# Altium project FF_FINAL_PROJECT.PrjPcb (part 1 of 3)
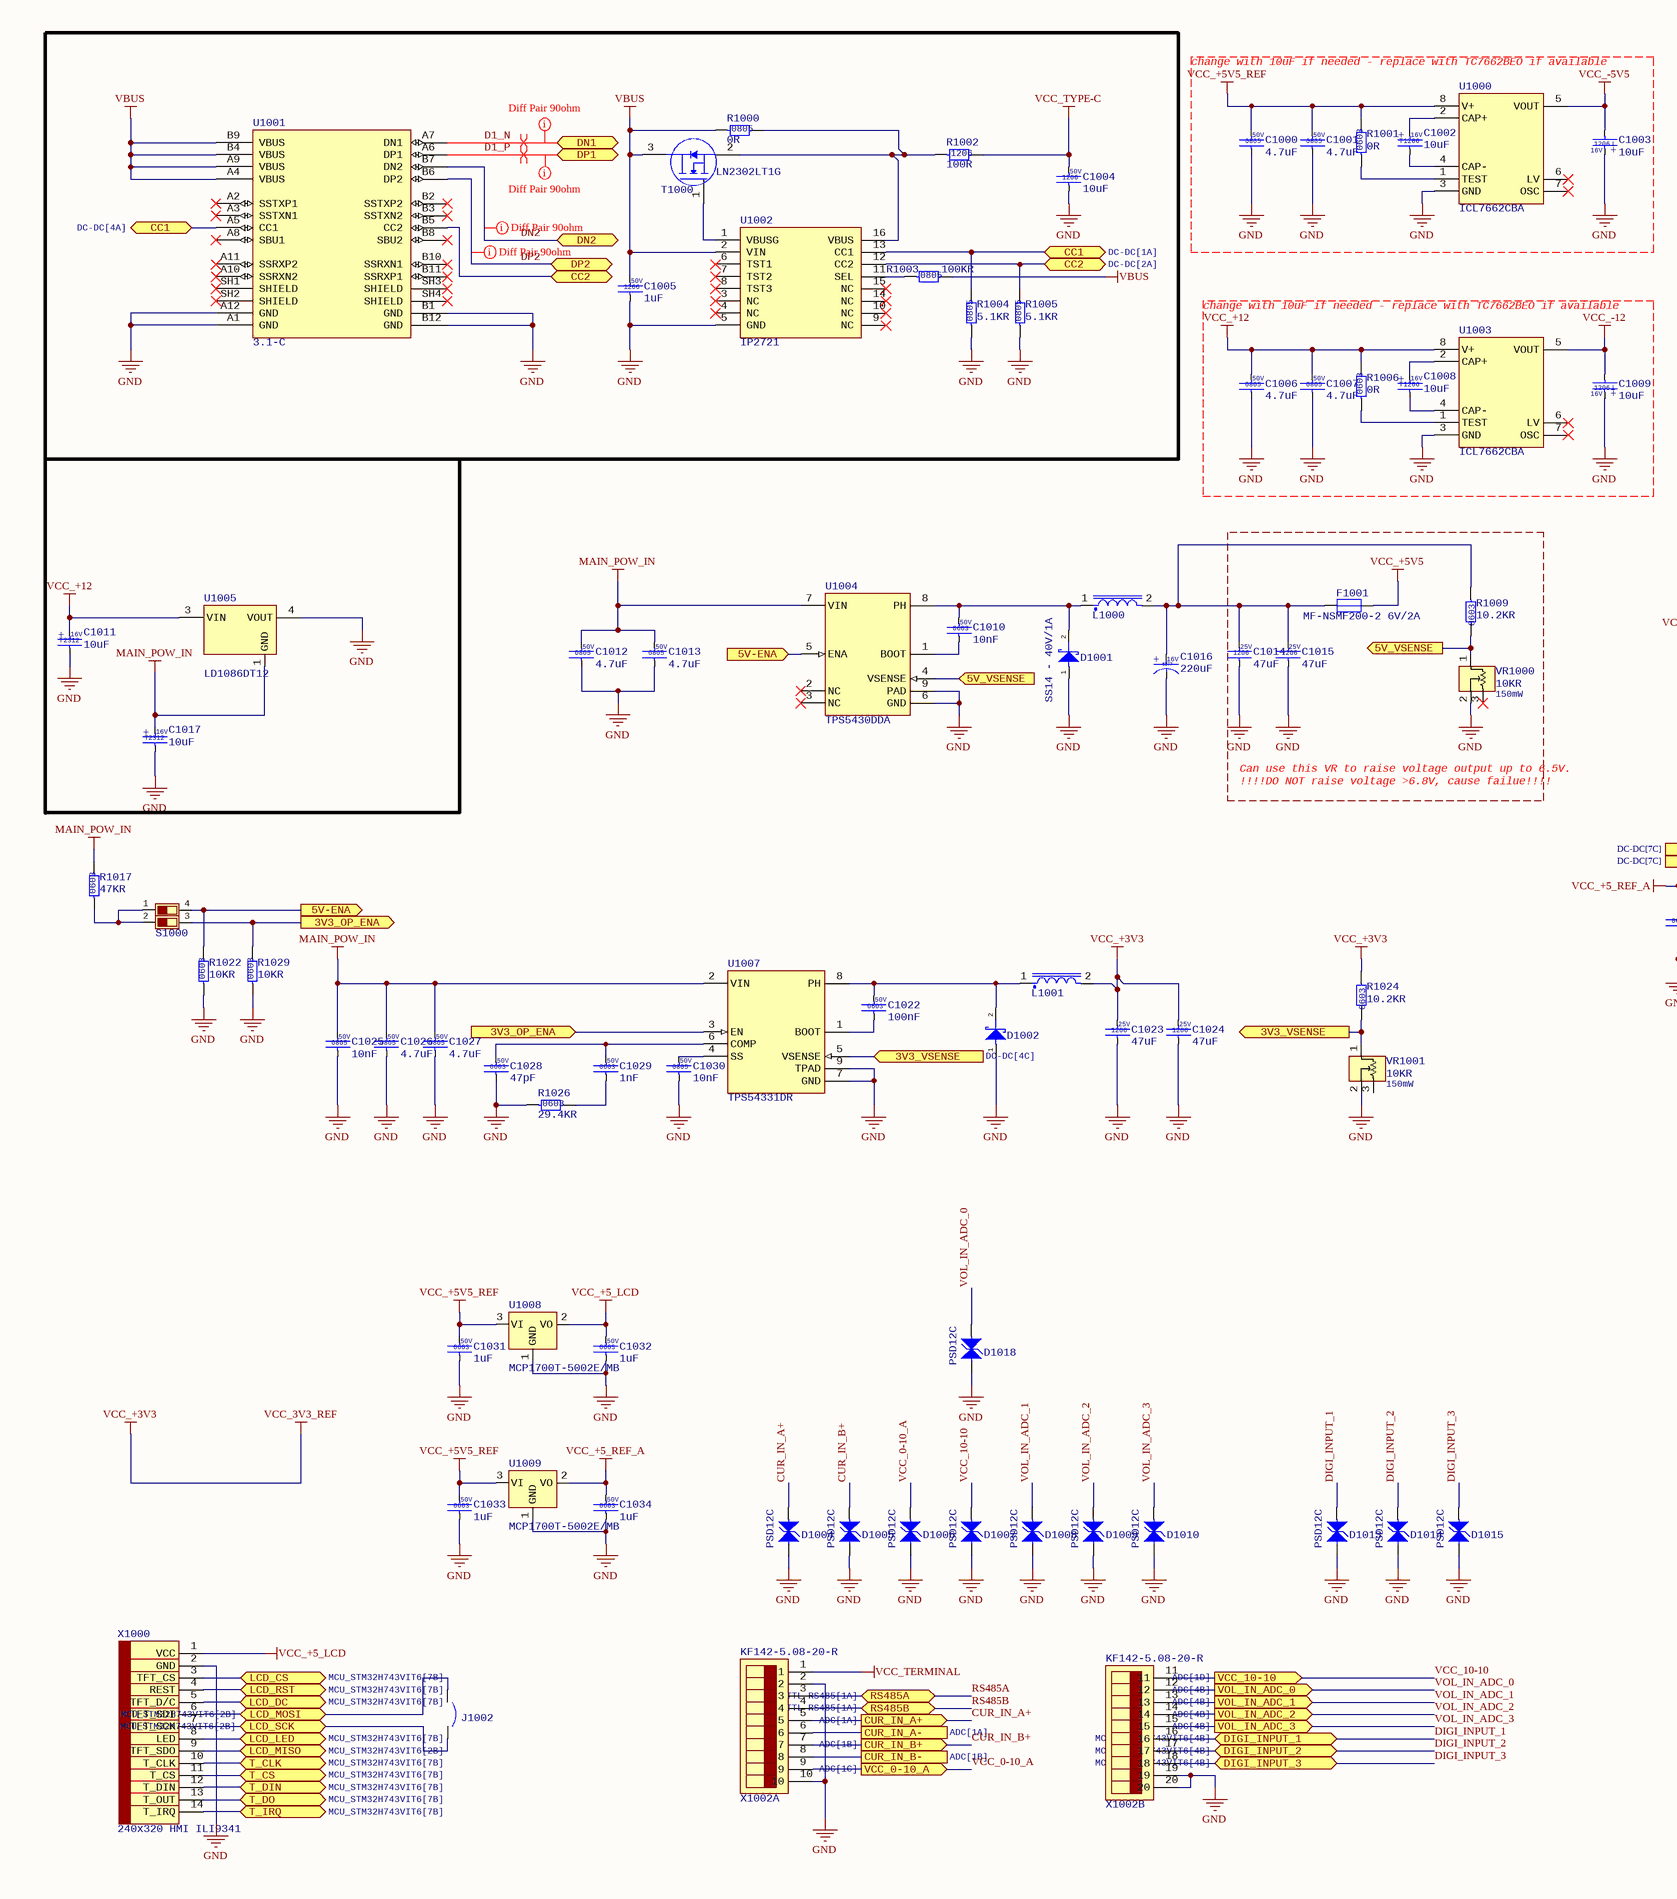
[diagram p0: DC-DC.SchDoc, left]
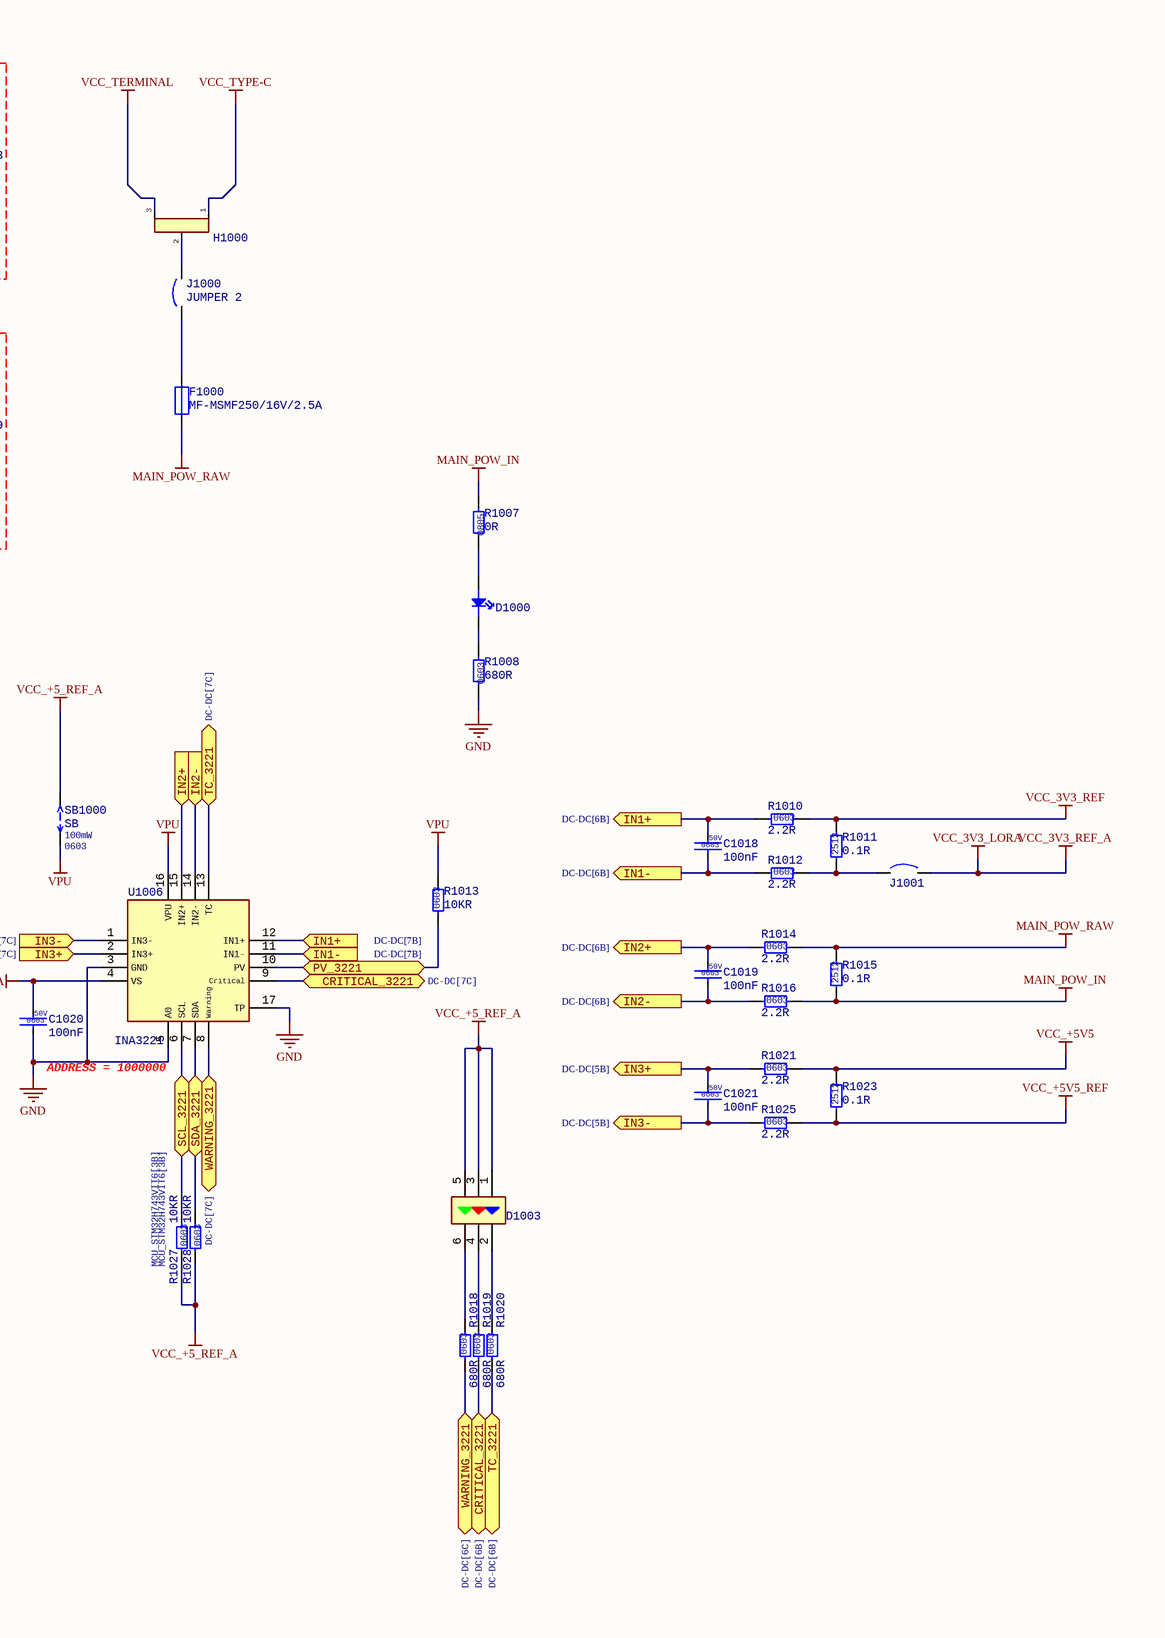
[diagram p1: DC-DC.SchDoc, right]
5 sheets, 337 parts. Net scope: flat (ports and power ports of the same name join across sheets).
Board files: FINAL_PCB_VER0.PcbDoc, FINAL_PCB_VER1.PcbDoc
Sheets:
  DC-DC.SchDoc
  TTL-RS485.SchDoc
  ADC.SchDoc
  ESP32-LORA_RA_08H.SchDoc
  MCU_STM32H743VIT6.SchDoc

## Sheet DC-DC.SchDoc
size A2; Author: Nguyễn Huy Hoàng; SheetNumber: 1; SheetTotal: 5; Instructor: Nguyễn Trung Hiếu

### Parts
C1000  4.7uF  Voltage: 50V  Size: 0805  [CAP CER 0805]
C1001  4.7uF  Voltage: 50V  Size: 0805  [CAP CER 0805]
C1002  10uF  Voltage: 16V  Size: 1206  [CAP TAN 1206]
C1003  10uF  Voltage: 16V  Size: 1206  [CAP TAN 1206]
C1004  10uF  Voltage: 50V  Size: 1206  [CAP CER 1206]
C1005  1uF  Voltage: 50V  Size: 1206  [CAP CER 1206]
C1006  4.7uF  Voltage: 50V  Size: 0805  [CAP CER 0805]
C1007  4.7uF  Voltage: 50V  Size: 0805  [CAP CER 0805]
C1008  10uF  Voltage: 16V  Size: 1206  [CAP TAN 1206]
C1009  10uF  Voltage: 16V  Size: 1206  [CAP TAN 1206]
C1010  10nF  Voltage: 50V  Size: 0603  [CAP CER 0603]
C1011  10uF  Voltage: 16V  Size: 2312  [CAP TAN 2312]
C1012  4.7uF  Voltage: 50V  Size: 0805  [CAP CER 0805]
C1013  4.7uF  Voltage: 50V  Size: 0805  [CAP CER 0805]
C1014  47uF  Voltage: 25V  Size: 1206  [CAP CER 1206]
C1015  47uF  Voltage: 25V  Size: 1206  [CAP CER 1206]
C1016  220uF  Voltage: 16V  Size: 6377  [CAP ALUM 6377]
C1017  10uF  Voltage: 16V  Size: 2312  [CAP TAN 2312]
C1018  100nF  Voltage: 50V  Size: 0603  [CAP CER 0603]
C1019  100nF  Voltage: 50V  Size: 0603  [CAP CER 0603]
C1020  100nF  Voltage: 50V  Size: 0603  [CAP CER 0603]
C1021  100nF  Voltage: 50V  Size: 0603  [CAP CER 0603]
C1022  100nF  Voltage: 50V  Size: 0603  [CAP CER 0603]
C1023  47uF  Voltage: 25V  Size: 1206  [CAP CER 1206]
C1024  47uF  Voltage: 25V  Size: 1206  [CAP CER 1206]
C1025  10nF  Voltage: 50V  Size: 0805  [CAP CER 0805]
C1026  4.7uF  Voltage: 50V  Size: 0805  [CAP CER 0805]
C1027  4.7uF  Voltage: 50V  Size: 0805  [CAP CER 0805]
C1028  47pF  Voltage: 50V  Size: 0603  [CAP CER 0603]
C1029  1nF  Voltage: 50V  Size: 0603  [CAP CER 0603]
C1030  10nF  Voltage: 50V  Size: 0805  [CAP CER 0805]
C1031  1uF  Voltage: 50V  Size: 0603  [CAP CER 0603]
C1032  1uF  Voltage: 50V  Size: 0603  [CAP CER 0603]
C1033  1uF  Voltage: 50V  Size: 0603  [CAP CER 0603]
C1034  1uF  Voltage: 50V  Size: 0603  [CAP CER 0603]
D1000  LED RED  [LED RED 0603]  (value not drawn)
D1001  SS14 - 40V/1A  [DO-214AC]
D1002  SS14 - 40V/1A  [DO-214AC]  (value not drawn)
D1003  LED RGB 5050  [LED RGB 5050]  (value not drawn)
D1004  PSD12C  [SOD-323]
D1005  PSD12C  [SOD-323]
D1006  PSD12C  [SOD-323]
D1007  PSD12C  [SOD-323]
D1008  PSD12C  [SOD-323]
D1009  PSD12C  [SOD-323]
D1010  PSD12C  [SOD-323]
D1013  PSD12C  [SOD-323]
D1014  PSD12C  [SOD-323]
D1015  PSD12C  [SOD-323]
D1018  PSD12C  [SOD-323]
F1000  MF-MSMF250/16V/2.5A  [FUSE 1812]
F1001  MF-NSMF200-2 6V/2A  [FUSE 1206]
H1000  3PIN JUMPER  [JUMPER 3]  (value not drawn)
J1000  JUMPER 2  [JUMPER 2]
J1001  JUMPER 2  [JUMPER 2]  (value not drawn)
J1002  JUMPER 2  [JUMPER 2]  (value not drawn)
L1000  LD127-22uH  [INDUCTOR 1280]  (value not drawn)
L1001  LD127-6.8uH  [INDUCTOR 1280]  (value not drawn)
R1000  0R  Size: 0805  [RESC 0805(2012) SMD]
R1001  0R  Size: 0603  [RESC 0603(1608) SMD]
R1002  100R  Size: 1206  [RESC 1206(3116) SMD]
R1003  100KR  Size: 0805  [RESC 0805(2012) SMD]
R1004  5.1KR  Size: 0805  [RESC 0805(2012) SMD]
R1005  5.1KR  Size: 0805  [RESC 0805(2012) SMD]
R1006  0R  Size: 0603  [RESC 0603(1608) SMD]
R1007  0R  Size: 0805  [RESC 0805(2012) SMD]
R1008  680R  Size: 0603  [RESC 0603(1608) SMD]
R1009  10.2KR  Size: 0603  [RESC 0603(1608) SMD]
R1010  2.2R  Size: 0603  [RESC 0603(1608) SMD]
R1011  0.1R  Size: 2512  [RESC 2512 SMD]
R1012  2.2R  Size: 0603  [RESC 0603(1608) SMD]
R1013  10KR  Size: 0603  [RESC 0603(1608) SMD]
R1014  2.2R  Size: 0603  [RESC 0603(1608) SMD]
R1015  0.1R  Size: 2512  [RESC 2512 SMD]
R1016  2.2R  Size: 0603  [RESC 0603(1608) SMD]
R1017  47KR  Size: 0603  [RESC 0603(1608) SMD]
R1018  680R  Size: 0603  [RESC 0603(1608) SMD]
R1019  680R  Size: 0603  [RESC 0603(1608) SMD]
R1020  680R  Size: 0603  [RESC 0603(1608) SMD]
R1021  2.2R  Size: 0603  [RESC 0603(1608) SMD]
R1022  10KR  Size: 0603  [RESC 0603(1608) SMD]
R1023  0.1R  Size: 2512  [RESC 2512 SMD]
R1024  10.2KR  Size: 0603  [RESC 0603(1608) SMD]
R1025  2.2R  Size: 0603  [RESC 0603(1608) SMD]
R1026  29.4KR  Size: 0603  [RESC 0603(1608) SMD]
R1027  10KR  Size: 0603  [RESC 0603(1608) SMD]
R1028  10KR  Size: 0603  [RESC 0603(1608) SMD]
R1029  10KR  Size: 0603  [RESC 0603(1608) SMD]
S1000  DIP-2  [DIP-2 SWITCH]  (value not drawn)
SB1000  SB  Power Rate: 100mW  Size: 0603  [SB]
T1000  LN2302LT1G  [SOT23-3]
U1000  ICL7662CBA  [SOP-8]
U1001  3.1-C  [USB TYPE C FEMALE]
U1002  IP2721  [TSSOP-16]
U1003  ICL7662CBA  [SOP-8]
U1004  TPS5430DDA  [SO PowerPAD]
U1005  LD1086DT12  [DPAK]
U1006  INA3221  [VQFN-16]
U1007  TPS54331DR  [SOIC-8]
U1008  MCP1700T-5002E/MB  [SOT23-3]
U1009  MCP1700T-5002E/MB  [SOT23-3]
VR1000  10KR  Power Rate: 150mW  [VARIABLE RESISTOR]
VR1001  10KR  Power Rate: 150mW  [VARIABLE RESISTOR]
X1000  240x320 HMI ILI9341  [LCD TFT320x240]
X1002  KF142-5.08-20-R  [TERMINAL BLOCK 20 5.08MM]  (parts A,B of 2)

### Ports
3V3_OP_ENA (in, see DC-DC[1B]), 3V3_OP_ENA (out, see DC-DC[2C]), 3V3_VSENSE (in, see DC-DC[4C]), 3V3_VSENSE (out, see DC-DC[3C]), 5V-ENA (in, see DC-DC[1B]), 5V-ENA (out, see DC-DC[3B]), 5V_VSENSE (in, see DC-DC[5B]), 5V_VSENSE (out, see DC-DC[3B]), CC1 (bidir, see DC-DC[1A]), CC1 (bidir, see DC-DC[4A]), CC2 (bidir, see DC-DC[2A]), CC2 (bidir, see DC-DC[4A]), CRITICAL_3221 (bidir, see DC-DC[6B]), CRITICAL_3221 (bidir, see DC-DC[7C]), CUR_IN_A+ (out, see ADC[1A]), CUR_IN_A- (see ADC[1A]), CUR_IN_B+ (out, see ADC[1B]), CUR_IN_B- (see ADC[1B]), DIGI_INPUT_1 (bidir, see MCU_STM32H743VIT6[4B]), DIGI_INPUT_2 (bidir, see MCU_STM32H743VIT6[4B]), DIGI_INPUT_3 (bidir, see MCU_STM32H743VIT6[4B]), DN1 (bidir, see MCU_STM32H743VIT6[1B], TTL-RS485[2C]), DN2 (bidir), DP1 (bidir, see MCU_STM32H743VIT6[1B], TTL-RS485[2C]), DP2 (bidir), IN1+ (in, see DC-DC[7B]), IN1+ (out, see DC-DC[6B]), IN1- (in, see DC-DC[7B]), IN1- (out, see DC-DC[6B]), IN2+ (in, see DC-DC[7B]), IN2+ (out, see DC-DC[6B]), IN2- (in, see DC-DC[7B]), IN2- (out, see DC-DC[6B]), IN3+ (in, see DC-DC[7C]), IN3+ (out, see DC-DC[5B]), IN3- (in, see DC-DC[7C]), IN3- (out, see DC-DC[5B]), LCD_CS (bidir, see MCU_STM32H743VIT6[7B]), LCD_DC (bidir, see MCU_STM32H743VIT6[7B]), LCD_LED (bidir, see MCU_STM32H743VIT6[7B]), LCD_MISO (bidir, see MCU_STM32H743VIT6[2B]), LCD_MOSI (bidir, see MCU_STM32H743VIT6[2B]), LCD_RST (bidir, see MCU_STM32H743VIT6[7B]), LCD_SCK (bidir, see MCU_STM32H743VIT6[2B]), PV_3221 (bidir), RS485A (bidir, see TTL-RS485[1A]), RS485B (bidir, see TTL-RS485[1A]), SCL_3221 (bidir, see MCU_STM32H743VIT6[3B]), SDA_3221 (bidir, see MCU_STM32H743VIT6[3B]), T_CLK (bidir, see MCU_STM32H743VIT6[7B]), T_CS (bidir, see MCU_STM32H743VIT6[7B]), T_DIN (bidir, see MCU_STM32H743VIT6[7B]), T_DO (bidir, see MCU_STM32H743VIT6[7B]), T_IRQ (bidir, see MCU_STM32H743VIT6[7B]), TC_3221 (bidir, see DC-DC[6B]), TC_3221 (bidir, see DC-DC[7C]), VCC_0-10_A (out, see ADC[1C]), VCC_10-10 (out, see ADC[1D]), VOL_IN_ADC_0 (out, see ADC[4B]), VOL_IN_ADC_1 (out, see ADC[4B]), VOL_IN_ADC_2 (out, see ADC[4B]), VOL_IN_ADC_3 (out, see ADC[4B]), WARNING_3221 (bidir, see DC-DC[6C]), WARNING_3221 (bidir, see DC-DC[7C])

### Nets
GND: C1000.2 C1001.2 C1003.2(P) C1004.2 C1005.2 C1006.2 C1007.2 C1009.2(P) C1011.1(N) C1012.2 C1013.2 C1014.2 C1015.2 C1016.1(C) C1017.1(N) C1020.2 C1023.2 C1024.2 C1025.2 C1026.2 C1027.2 C1028.2 C1030.2 C1031.2 C1032.2 C1033.2 C1034.2 D1001.1(A) D1002.1(A) D1004.2 D1005.2 D1006.2 D1007.2 D1008.2 D1009.2 D1010.2 D1013.2 D1014.2 D1015.2 D1018.2 R1004.1 R1005.1 R1008.2 R1022.1 R1026.1 R1029.1 U1000.3(GND) U1001.A1(GND) U1001.A12(GND) U1001.B1(GND) U1001.B12(GND) U1002.5(GND) U1003.3(GND) U1004.6(GND) U1004.9(PAD) U1005.4(VOUT) U1006.3(GND) U1006.5(A0) U1006.17(TP) U1007.7(GND) U1007.9(TPAD) U1008.1(GND) U1009.1(GND) VR1000.2(b) VR1001.2(b) X1000.2(GND) X1002.2 X1002.6 X1002.8 X1002.10 X1002.19 X1002.20 ; port CUR_IN_A-, port CUR_IN_B-
MAIN_POW_IN: C1012.1 C1013.1 C1017.2(P) C1025.1 C1026.1 C1027.1 R1007.1 R1015.1 R1016.2 R1017.2 U1004.7(VIN) U1005.1(GND) U1007.2(VIN)
MAIN_POW_RAW: F1000.2 R1014.2 R1015.2
VBUS: C1005.1 R1000.1 R1003.2 T1000.3(D) U1001.A4(VBUS) U1001.A9(VBUS) U1001.B4(VBUS) U1001.B9(VBUS) U1002.2(VIN)
VCC_3V3_LORA: J1001.2  [also labelled VCC_3V3_REF_A]
VCC_+3V3: C1023.1 C1024.1 L1001.2 R1010.2 R1011.2 R1024.1  [also labelled VCC_3V3_REF]
VCC_+5_LCD: C1032.1 U1008.2(VO) X1000.1(VCC)
VCC_+5_REF_A: C1020.1 C1034.1 D1003.1 D1003.3 D1003.5 R1027.1 R1028.1 SB1000.2 U1006.4(VS) U1009.2(VO)
VCC_+5V5: F1001.2 R1021.2 R1023.2
VCC_+5V5_REF: C1000.1 C1001.1 C1031.1 C1033.1 R1001.2 R1023.1 R1025.2 U1000.8(V+) U1008.3(VI) U1009.3(VI)
VCC_+12: C1006.1 C1007.1 C1011.2(P) R1006.2 U1003.8(V+) U1005.3(VIN)
VCC_-5V5: C1003.1(N) U1000.5(VOUT)
VCC_-12: C1009.1(N) U1003.5(VOUT)
VCC_TERMINAL: H1000.3 X1002.1
VCC_TYPE-C: C1004.1 H1000.1 R1002.2
VPU: R1013.2 SB1000.1 U1006.16(VPU)
CUR_IN_A+: D1004.1 X1002.5 ; port CUR_IN_A+
CUR_IN_B+: D1005.1 X1002.7 ; port CUR_IN_B+
D1_N: U1001.A7(DN1) ; port DN1
D1_P: U1001.A6(DP1) ; port DP1
DIGI_INPUT_1: D1013.1 X1002.16 ; port DIGI_INPUT_1
DIGI_INPUT_2: D1014.1 X1002.17 ; port DIGI_INPUT_2
DIGI_INPUT_3: D1015.1 X1002.18 ; port DIGI_INPUT_3
DN2: U1001.B7(DN2) ; port DN2
DP2: U1001.B6(DP2) ; port DP2
I2C2_SCL: R1027.2 U1006.6(SCL) ; port SCL_3221
I2C2_SDA: R1028.2 U1006.7(SDA) ; port SDA_3221
MCU29: J1002.2 X1000.7(TFT_SCK) ; port LCD_SCK
MCU30: X1000.9(TFT_SDO) ; port LCD_MISO
MCU31: J1002.1 X1000.6(TFT_SDI) ; port LCD_MOSI
MCU37: X1000.3(TFT_CS) ; port LCD_CS
MCU38: X1000.4(REST) ; port LCD_RST
MCU39: X1000.5(TFT_D/C) ; port LCD_DC
MCU40: X1000.8(LED) ; port LCD_LED
MCU41: X1000.11(T_CS) ; port T_CS
MCU42: X1000.10(T_CLK) ; port T_CLK
MCU43: X1000.12(T_DIN) ; port T_DIN
MCU44: X1000.13(T_OUT) ; port T_DO
MCU45: X1000.14(T_IRQ) ; port T_IRQ
RS485A: X1002.3 ; port RS485A
RS485B: X1002.4 ; port RS485B
VCC_0-10_A: D1006.1 X1002.9 ; port VCC_0-10_A
VCC_10-10: D1007.1 X1002.11 ; port VCC_10-10
VOL_IN_ADC_0: D1018.1 X1002.12 ; port VOL_IN_ADC_0
VOL_IN_ADC_1: D1008.1 X1002.13 ; port VOL_IN_ADC_1
VOL_IN_ADC_2: D1009.1 X1002.14 ; port VOL_IN_ADC_2
VOL_IN_ADC_3: D1010.1 X1002.15 ; port VOL_IN_ADC_3
NetC1002_1: C1002.1(N) U1000.4(CAP-)
NetC1002_2: C1002.2(P) U1000.2(CAP+)
NetC1008_1: C1008.1(N) U1003.4(CAP-)
NetC1008_2: C1008.2(P) U1003.2(CAP+)
NetC1010_1: C1010.1 D1001.2(K) L1000.1 U1004.8(PH)
NetC1010_2: C1010.2 U1004.1(BOOT)
NetC1014_1: C1014.1 C1015.1 C1016.2(A) F1001.1 L1000.2 R1009.1
NetC1018_1: C1018.1 R1010.1 U1006.12(IN1+) ; port IN1+
NetC1018_2: C1018.2 R1012.1 U1006.11(IN1-) ; port IN1-
NetC1019_1: C1019.1 R1014.1 U1006.15(IN2+) ; port IN2+
NetC1019_2: C1019.2 R1016.1 U1006.14(IN2-) ; port IN2-
NetC1021_1: C1021.1 R1021.1 U1006.2(IN3+) ; port IN3+
NetC1021_2: C1021.2 R1025.1 U1006.1(IN3-) ; port IN3-
NetC1022_1: C1022.1 D1002.2(K) L1001.1 U1007.8(PH)
NetC1022_2: C1022.2 U1007.1(BOOT)
NetC1028_1: C1028.1 C1029.1 U1007.6(COMP)
NetC1029_2: C1029.2 R1026.2
NetC1030_1: C1030.1 U1007.4(SS)
NetD1000_1: D1000.1 R1007.2
NetD1000_2: D1000.2 R1008.1
NetD1003_2: D1003.2 R1020.2
NetD1003_4: D1003.4 R1019.2
NetD1003_6: D1003.6 R1018.2
NetF1000_1: F1000.1 J1000.1
NetH1000_2: H1000.2 J1000.2
NetJ1001_1: J1001.1 R1011.1 R1012.2
NetR1000_2: R1000.2 R1002.1 T1000.2(S) U1002.16(VBUS)
NetR1001_1: R1001.1 U1000.1(TEST)
NetR1003_1: R1003.1 U1002.11(SEL)
NetR1004_2: R1004.2 U1001.A5(CC1) U1002.13(CC1) ; port CC1
NetR1005_2: R1005.2 U1001.B5(CC2) U1002.12(CC2) ; port CC2
NetR1006_1: R1006.1 U1003.1(TEST)
NetR1009_2: R1009.2 U1004.4(VSENSE) VR1000.1(a) ; port 5V_VSENSE
NetR1013_1: R1013.1 U1006.10(PV) ; port PV_3221
NetR1017_1: R1017.1 S1000.1 S1000.2
NetR1018_1: R1018.1 U1006.8(Warning) ; port WARNING_3221
NetR1019_1: R1019.1 U1006.9(Critical) ; port CRITICAL_3221
NetR1020_1: R1020.1 U1006.13(TC) ; port TC_3221
NetR1022_2: R1022.2 S1000.4 U1004.5(ENA) ; port 5V-ENA
NetR1024_2: R1024.2 U1007.5(VSENSE) VR1001.1(a) ; port 3V3_VSENSE
NetR1029_2: R1029.2 S1000.3 U1007.3(EN) ; port 3V3_OP_ENA
NetT1000_1: T1000.1(G) U1002.1(VBUSG)

Not connected (* = marked no-connect by the designer): U1000 6(LV)* 7(OSC)*; U1001 A2(SSTXP1)* A3(SSTXN1)* A8(SBU1)* A10(SSRXN2)* A11(SSRXP2)* B2(SSTXP2)* B3(SSTXN2)* B8(SBU2)* B10(SSRXN1)* B11(SSRXP1)* SH1(SHIELD)* SH2(SHIELD)* SH3(SHIELD)* SH4(SHIELD)*; U1002 3(NC)* 4(NC)* 6(TST1)* 7(TST2)* 8(TST3)* 9(NC)* 10(NC)* 14(NC)* 15(NC)*; U1003 6(LV)* 7(OSC)*; U1004 2(NC)* 3(NC)*; VR1000 3(c)*; VR1001 3(c)

### Layout directives
mark named Diff Pair 90ohm: D1_N, D1_P, DN2, DP2
differential pair: D1_N, D1_P

### Notes on the sheet
- (near U1000) change with 10uF if needed - replace with TC7662BEO if available
- (near U1003) change with 10uF if needed - replace with TC7662BEO if available
- Can use this VR to raise voltage output up to 6.5V.
- !!!!DO NOT raise voltage >6.8V, cause failue!!!!
- ADDRESS = 1000000
- PROJECT:
- A2
- SIZE
- Author:
- Instructors:
- Project Document Name:
- Modified day:
- Approved by:
- (in symbol FF-1002) +
- (in symbol FF-1022) +; T
- (in symbol FF-1034) T; +

### Library data of the parts
C1000 C1001 C1006 C1007 C1012 C1013 C1026 C1027 = FF-1010: CAP CER SMD 4.7uF 10% 50V 0805; Type: CAP CER; Design Item ID: FF-1010; TH/SMD: SMD; Value: 4.7uF; Tolerance: 10%; Power Rate: N/A; Supplier: THEGIOIIC; Supplier Part Number: 10%, 0805 (2012 Metric); Supplier Link: https://www.thegioiic.com/tu-gom-0805-4-7uf-50v
C1002 C1003 C1008 C1009 = FF-1034: CAP TAN SMD 10uF 10% 16V 1206; Type: CAP TAN; Value: 10uF; Design Item ID: FF-1034; TH/SMD: SMD; Tolerance: 10%; Power Rate: N/A; Supplier: THEGIOIIC; Supplier Part Number: Tụ Tantalum 10uF 16V 1206 TAJA106K016RNJ; Supplier Link: https://www.thegioiic.com/tu-tantalum-10uf-16v-1206-taja106k016rnj
C1004 = FF-1019: CAP CER SMD 10uF 10% 50V 1206; Type: CAP CER; Design Item ID: FF-1019; TH/SMD: SMD; Value: 10uF; Tolerance: 10%; Power Rate: N/A; Supplier: THEGIOIIC; Supplier Part Number: 10%, 1206 (3216 Metric); Supplier Link: https://www.thegioiic.com/tu-gom-1206-10uf-50v
C1005 = FF-1018: CAP CER SMD 1uF 10% 50V 1206; Type: CAP CER; Design Item ID: FF-1018; TH/SMD: SMD; Value: 1uF; Tolerance: 10%; Power Rate: N/A; Supplier: THEGIOIIC; Supplier Part Number: 10%, 1206 (3216 Metric); Supplier Link: https://www.thegioiic.com/tu-gom-1206-1uf-50v
C1010 = FF-1033: CAP CER SMD 10nF 10% 50V 0603; Type: CAP CER; Design Item ID: FF-1033; TH/SMD: SMD; Value: 10nF; Tolerance: 10%; Power Rate: N/A; Supplier: THEGIOIIC; Supplier Part Number: 10%, 0603 (1608 Metric); Supplier Link: https://www.thegioiic.com/tu-gom-0603-10nf-50v
C1011 C1017 = FF-1022: CAP TAN SMD 10uF 10% 16V 2312; Type: CAP TAN; Value: 10uF; Design Item ID: FF-1022; TH/SMD: SMD; Tolerance: 10%; Power Rate: N/A; Supplier: THEGIOIIC; Supplier Part Number: 106 10%, 2312 (6032 Metric); Supplier Link: https://www.thegioiic.com/tu-tantalum-10uf-16v-2312-tajc106k016rnj
C1014 C1015 C1023 C1024 = FF-1024: CAP CER SMD 47uF 10% 25V 1206; Type: CAP CER; Design Item ID: FF-1024; TH/SMD: SMD; Value: 47uF; Tolerance: 10%; Power Rate: N/A; Supplier: THEGIOIIC; Supplier Part Number: 10%, 1206 (3216 Metric); Supplier Link: https://www.thegioiic.com/tu-gom-1206-47uf-16v
C1016 = FF-1002: CAP ALUM SMD 220uF 20% 16V 6377; Design Item ID: FF-1002; Type: CAP ALUM; TH/SMD: SMD; Value: 220uF; Tolerance: 20%; Power Rate: N/A; Supplier: THEGIOIIC; Supplier Part Number: Tụ hóa 220uF 16V, 20%; Supplier Link: https://www.thegioiic.com/tu-nhom-smd-220uf-16v-6-3x7-7mm
C1018-C1022 = FF-1008: CAP CER SMD 100nF 10% 50V 0603; Type: CAP CER; Value: 100nF; Design Item ID: FF-1008; TH/SMD: SMD; Tolerance: 10%; Power Rate: N/A; Supplier: THEGIOIIC; Supplier Link: https://www.thegioiic.com/tu-gom-0603-100nf-0-1uf-50v; Supplier Part Number: 10%, 0603 (1608 Metric)
C1025 C1030 = FF-1023: CAP CER SMD 10nF 10% 50V 0805; Type: CAP CER; Design Item ID: FF-1023; TH/SMD: SMD; Value: 10nF; Tolerance: 10%; Power Rate: N/A; Supplier: THEGIOIIC; Supplier Part Number: 10%, 0805 (2012 Metric); Supplier Link: https://www.thegioiic.com/tu-gom-0805-10nf-50v
C1028 = FF-1028: CAP CER SMD 47pF 10% 50V 0603; Type: CAP CER; Design Item ID: FF-1028; TH/SMD: SMD; Value: 47pF; Tolerance: 10%; Power Rate: N/A; Supplier: THEGIOIIC; Supplier Part Number: 10%, 0603 (1608 Metric); Supplier Link: https://www.thegioiic.com/tu-gom-0603-47pf-50v
C1029 = FF-1015: CAP CER SMD 1nF 10% 50V 0603; Type: CAP CER; Design Item ID: FF-1015; TH/SMD: SMD; Value: 1nF; Tolerance: 10%; Power Rate: N/A; Supplier: THEGIOIIC; Supplier Part Number: 10%, 0603 (1608 Metric); Supplier Link: https://www.thegioiic.com/tu-gom-0603-1nf-50v
C1031-C1034 = FF-1017: CAP CER SMD 1uF 10% 50V 0603; Type: CAP CER; Design Item ID: FF-1017; TH/SMD: SMD; Value: 1uF; Tolerance: 10%; Power Rate: N/A; Supplier: THEGIOIIC; Supplier Part Number: 10%, 0603 (1608 Metric); Supplier Link: https://www.thegioiic.com/tu-gom-0603-1uf-50v
D1000 = FF-4011: LED RED 0603; TH/SMD: SMD; Design Item ID: FF-4011; Type: LED; Value: N/A; Tolerance: N/A; Voltage: N/A; Power Rate: N/A; Size: 0603; Supplier: THEGIOIIC; Supplier Part Number: LED Đỏ 0603 Dán SMD Trong Suốt; Supplier Link: https://www.thegioiic.com/led-do-0603-dan-smd-trong-suot
D1001 D1002 = FF-4005: Size A, DIODE SCHOTTKY 1A 40V SMA; TH/SMD: SMD; Design Item ID: FF-4005; Type: DIODE SCHOTTKY; Value: 1A; Tolerance: N/A; Voltage: N/A; Power Rate: N/A; Size: DO-214AC; Supplier: THEGIOIIC; Supplier Part Number: SS14; Supplier Link: https://www.thegioiic.com/ss14-sma-diode-schottky-1a-1n5819
D1003 = FF-4018: LED RGB 5050 Dán SMD Trong Suốt; Value: 5 x 5 x 1.5mm; Design Item ID: FF-4018; Type: LED RGB; TH/SMD: SMD; Tolerance: N/A; Voltage: N/A; Power Rate: N/A; Size: 5050; Supplier: THEGIOIIC; Supplier Part Number: LED RGB 5050 Dán SMD Trong Suốt; Supplier Link: https://www.thegioiic.com/led-rgb-5050-dan-smd-trong-suot
D1004-D1010 D1013-D1015 D1018 = FF-4015: Package SOD323, Diode TVS, 50pF, 29.5V; TH/SMD: SMD; Design Item ID: FF-4015; Type: TVS DIODE; Value: 50 pF, 29.5V; Tolerance: N/A; Voltage: 29.5V; Power Rate: N/A; Size: SOD-323; Supplier: THEGIOIIC; Supplier Part Number: PSD12C; Supplier Link: https://www.thegioiic.com/psd12c
F1000 = FF-4009: Size: 4.55x3.24 mm, -40°C ~ 85°C; TH/SMD: SMD; Voltage: 16V; Design Item ID: FF-4009; Type: FUSE; Value: 16V/2.5A; Tolerance: N/A; Power Rate: N/A; Size: 1812; Supplier Part Number: MF-MSMF250/16; Supplier Link: https://www.thegioiic.com/mf-msmf250-16-cau-chi-tu-phuc-hoi-1812-16v-2-5a
F1001 = FF-4008: Size: 3.2x1.6 mm, -40°C ~ 85°C; TH/SMD: SMD; Voltage: 6V; Design Item ID: FF-4008; Type: FUSE; Value: 6V/2A; Tolerance: N/A; Power Rate: N/A; Size: 1206; Supplier: THEGIOIIC; Supplier Part Number: MF-NSMF200-2; Supplier Link: https://www.thegioiic.com/mf-nsmf200-2-cau-chi-tu-phuc-hoi-1206-6v-2a
H1000 = FF-4010: TH/SMD: TH; Design Item ID: FF-4010; Type: JUMPER; Value: N/A; Tolerance: N/A; Voltage: N/A; Power Rate: N/A; Size: N/A; Supplier: N/A; Supplier Part Number: N/A; Supplier Link: N/A
J1000-J1002 = FF-3015: TH/SMD: TH; Design Item ID: FF-3015; Type: JUMPER; Value: N/A; Tolerance: N/A; Voltage: N/A; Power Rate: N/A; Size: 2 X 2.54mm; Supplier: N/A; Supplier Part Number: N/A; Supplier Link: N/A
L1000 = FF-4025: 20%, size 12X12X7 mm 22uH - 3A; TH/SMD: SMD; Design Item ID: FF-4025; Type: INDUCTOR; Value: N/A; Tolerance: N/A; Voltage: N/A; Power Rate: 3A; Size: INDUCTOR 1280; Supplier: N/A; Supplier Part Number: N/A; Supplier Link: N/A
L1001 = FF-4026: 20%, size 12X12X7 mm 6.8uH - 3A; TH/SMD: SMD; Design Item ID: FF-4026; Type: INDUCTOR; Value: N/A; Tolerance: N/A; Voltage: N/A; Power Rate: 3A; Size: INDUCTOR 1281; Supplier: N/A; Supplier Part Number: N/A; Supplier Link: N/A
R1000 R1007 = FF-0004: RESISTOR SMD 0R OHM 1% 125mW 0805; Power Rate: 125mW; Design Item ID: FF-0004; Type: RESISTOR; TH/SMD: SMD; Value: 0R; Tolerance: 1%; Voltage: N/A; Supplier: THEGIOIIC; Supplier Part Number: 0R0, 1/8W; Supplier Link: https://www.thegioiic.com/dien-tro-0-ohm-0805-1-
R1001 R1006 = FF-0003: RESISTOR SMD 0R OHM 1% 100mW 0603; Power Rate: 100mW; Design Item ID: FF-0003; Type: RESISTOR; TH/SMD: SMD; Value: 0R; Tolerance: 1%; Voltage: N/A; Supplier: THEGIOIIC; Supplier Part Number: 0R0, 1/10W; Supplier Link: https://www.thegioiic.com/dien-tro-0-ohm-0603-1-
R1002 = FF-0032: RESISTOR SMD 100R OHM 1% 250mW 1206; Power Rate: 250mW; Design Item ID: FF-0032; Type: RESISTOR; TH/SMD: SMD; Value: 100R; Tolerance: 1%; Voltage: N/A; Supplier: THEGIOIIC; Supplier Part Number: 1000, 1/4W; Supplier Link: https://www.thegioiic.com/dien-tro-100-ohm-1206-1-
R1003 = FF-0030: RESISTOR SMD 100KR OHM 1% 125mW 0805; Power Rate: 125mW; Design Item ID: FF-0030; Type: RESISTOR; TH/SMD: SMD; Value: 100KR; Tolerance: 1%; Voltage: N/A; Supplier: THEGIOIIC; Supplier Part Number: 104, 1/8W; Supplier Link: https://www.thegioiic.com/dien-tro-100-kohm-0805-1-
R1004 R1005 = FF-0019: RESISTOR SMD 5.1KR OHM 1% 125mW 0805; Power Rate: 125mW; Design Item ID: FF-0019; Type: RESISTOR; TH/SMD: SMD; Value: 5.1KR; Tolerance: 1%; Voltage: N/A; Supplier: THEGIOIIC; Supplier Part Number: 512, 1/8W; Supplier Link: https://www.thegioiic.com/dien-tro-5-1-kohm-0805-1-
R1008 R1018-R1020 = FF-0001: RESISTOR SMD 680R OHM 5% 100mW 0603; Power Rate: 100mW; Design Item ID: FF-0001; Type: RESISTOR; TH/SMD: SMD; Value: 680R; Tolerance: 5%; Voltage: N/A; Supplier: THEGIOIIC; Supplier Part Number: 681, 1/10W; Supplier Link: https://www.thegioiic.com/dien-tro-680-ohm-0603-5-
R1009 R1024 = FF-0045: RESISTOR SMD 10.2KR OHM 1% 100mW 0603; Power Rate: 100mW; Design Item ID: FF-0045; Type: RESISTOR; TH/SMD: SMD; Value: 10.2KR; Tolerance: 1%; Voltage: N/A; Supplier: THEGIOIIC; Supplier Part Number: Code 1022, 1/10W; Supplier Link: https://www.thegioiic.com/dien-tro-10-2-kohm-0603-1-
R1010 R1012 R1014 R1016 R1021 R1025 = FF-0007: RESISTOR SMD 2.2R OHM 5% 100mW 0603; Type: RESISTOR; TH/SMD: SMD; Value: 2.2R; Tolerance: 5%; Voltage: N/A; Power Rate: 100mW; Supplier: THEGIOIIC; Supplier Part Number: 2R2, 1/10W; Supplier Link: https://www.thegioiic.com/dien-tro-2-2-ohm-0603-5-; Design Item ID: FF-0007
R1011 R1015 R1023 = FF-0015: RESISTOR SMD 0.1R OHM 1% 3W 2512; Type: RESISTOR; TH/SMD: SMD; Value: 0.1R; Tolerance: 1%; Voltage: N/A; Power Rate: 3W; Supplier: N/A; Supplier Part Number: N/A; Supplier Link: https://shopee.vn/Set-10-%C4%91i%E1%BB%87n-tr%E1%BB%9F-2512-SMD-3W-1-0.001R-0.01R-0.012R-0.03R-0.05R-0.06R-0.1R-0.2R-0.22R-0.3R-0.33R-0.5R-Ohm-i.81431289.21754478570?sp_atk=b639e265-1957-4573-9bf4-bd9b7052cf00&xptdk=b639e265-1957-4573-9bf4-bd9b7052cf00; Design Item ID: FF-0015
R1013 R1022 R1027-R1029 = FF-0020: RESISTOR SMD 10KR OHM 1% 100mW 0603; Type: RESISTOR; TH/SMD: SMD; Value: 10KR; Tolerance: 1%; Voltage: N/A; Power Rate: 100mW; Supplier: THEGIOIIC; Supplier Part Number: 103, 1/10W; Supplier Link: https://www.thegioiic.com/dien-tro-10-kohm-0603-1-; Design Item ID: FF-0020
R1017 = FF-0026: RESISTOR SMD 47KR OHM 1% 100mW 0603; Power Rate: 100mW; Design Item ID: FF-0026; Type: RESISTOR; TH/SMD: SMD; Value: 47KR; Tolerance: 1%; Voltage: N/A; Supplier: THEGIOIIC; Supplier Part Number: 473, 1/10W; Supplier Link: https://www.thegioiic.com/dien-tro-47-kohm-0603-1-
R1026 = FF-0044: RESISTOR SMD 29.4KR OHM 1% 100mW 0603; Power Rate: 100mW; Design Item ID: FF-0044; Type: RESISTOR; TH/SMD: SMD; Value: 29.4KR; Tolerance: 1%; Voltage: N/A; Supplier: N/A; Supplier Part Number: N/A; Supplier Link: https://shopee.vn/100-Chip-%C4%91i%E1%BB%87n-tr%E1%BB%9F-0402-0603-0805-1206-SMD-24.9K-25.5K-26.1K-26.7K-27K-27.4K-28K-28.7K-29.4K-30K-30.1K-30.9K-Ohm-1--i.384840934.3027056898
S1000 = FF-3009: DIP SWITCH 1.27mm 2 CONTACT; TH/SMD: SMD; Design Item ID: FF-3009; Type: SWITCH; Value: N/A; Tolerance: N/A; Voltage: N/A; Power Rate: N/A; Size: 2 X 1.27mm; Supplier: THEGIOIIC; Supplier Part Number: Công Tắc DIP Switch Dán SMD 2 Bit 1.27mm; Supplier Link: https://www.thegioiic.com/cong-tac-dip-switch-dan-smd-2-bit-1-27mm
SB1000 = FF-0052: RESISTOR SMD 0R OHM 1% 100mW 0603; Design Item ID: FF-0052; Type: RESISTOR; TH/SMD: SMD; Value: 0R; Tolerance: 1%; Voltage: N/A; Supplier: THEGIOIIC; Supplier Part Number: N/A; Supplier Link: N/A
T1000 = FF-4001: 20V N-Channel Enhancement-Mode MOSFET; Type: TRANSISTOR; TH/SMD: SMD; Value: 20V-2.8A-N; Design Item ID: FF-4001; Tolerance: N/A; Voltage: 20V; Power Rate: N/A; Size: SOT23-3; Supplier: THEGIOIIC; Supplier Part Number: LN2302LT1G; Supplier Link: https://www.thegioiic.com/ln2302lt1g-mosfet-kenh-n
U1000 U1003 = FF-2004: CMOS Voltage Converter; TH/SMD: SMD; Design Item ID: FF-2004; Type: IC; Value: ICL7662CBA; Tolerance: N/A; Voltage: N/A; Power Rate: N/A; Size: SOP-8; Supplier: SELF; Supplier Link: https://shopee.vn/ICL7662CBA-ICL7662-7662-SOP8-m%E1%BB%9Bi-(con)-i.193855127.10606790306?sp_atk=25ed1cbb-cd35-43c0-af45-c904425b01eb&xptdk=25ed1cbb-cd35-43c0-af45-c904425b01eb
U1001 = FF-3001: TYPE C 3.1 24 PIN; Design Item ID: FF-3001; Type: CONNECTOR; TH/SMD: TH/SMD; Value: N/A; Tolerance: N/A; Voltage: N/A; Power Rate: N/A; Size: N/A; Supplier: THEGIOIIC; Supplier Part Number: N/A; Supplier Link: https://www.thegioiic.com/cong-usb-cai-3-1-type-c-24-chan-cong-90-do
U1002 = FF-2013: TYPEC/PD2.0/PD3.0 Physical Layer IC for USB TYPEC input Interfaces; TH/SMD: SMD; Design Item ID: FF-2013; Type: IC; Value: IP2721; Tolerance: N/A; Voltage: N/A; Power Rate: N/A; Size: TSSOP-16; Supplier: SELF
U1004 = FF-2012: TPS543x 3-A, Wide Input Range, Step-Down Converter; TH/SMD: SMD; Design Item ID: FF-2012; Type: IC; Value: TPS5430DDA; Tolerance: N/A; Voltage: N/A; Power Rate: N/A; Size: SO PowerPAD; Supplier Link: https://shopee.vn/Combo-5-con-IC-ngu%E1%BB%93n-TPS5430-%C4%91%E1%BA%A7u-v%C3%A0o-5.5V-%C4%91%E1%BA%BFn-36V-3A-b%E1%BB%99-%C4%91i%E1%BB%81u-ch%E1%BB%89nh-gi%E1%BA%A3m-%C4%91i%E1%BB%87n-%C3%A1p-500kHz-i.682040620.19643083810?sp_atk=3768dd41-fafc-439a-93aa-7
U1005 = FF-2014: 1.5 A adjustable and fixed low drop positive voltage regulator; TH/SMD: SMD; Design Item ID: FF-2014; Type: IC; Value: LD1086DT12; Tolerance: N/A; Voltage: N/A; Power Rate: N/A; Size: DPAK; Supplier: THEGIOIIC; Supplier Part Number: LD1086DT12; Supplier Link: https://www.thegioiic.com/ld1086dt12-ic-on-ap-12v-1-5a
U1006 = FF-2006: INA3221 Triple-Channel, High-Side Measurement, Shunt and Bus Voltage Monitor with I2C- and SMBUS-Compatible Interface; TH/SMD: SMD; Design Item ID: FF-2006; Type: IC; Value: INA3221; Tolerance: N/A; Voltage: N/A; Power Rate: N/A; Size: VQFN-16; Supplier: SELF
U1007 = FF-2015: TPS54331 3-A, 28-V Input, Step Down DC-DC Converter With Eco-mode; TH/SMD: SMD; Design Item ID: FF-2015; Type: IC; Value: TPS54331DR; Tolerance: N/A; Voltage: N/A; Power Rate: N/A; Size: SOIC-8; Supplier: THEGIOIIC; Supplier Part Number: TPS54331DR; Supplier Link: https://www.thegioiic.com/tps54331dr-ic-dieu-chinh-giam-ap-3a-8-soic
U1008 U1009 = FF-2024: MCP1700T-5002E/MB Low Quiescent Current LDO; TH/SMD: SMD; Voltage: 6-6.9VDC; Power Rate: 250mA; Design Item ID: FF-2024; Type: IC; Value: MCP1700T-5002E/MB; Tolerance: N/A; Size: SOT-23; Supplier: THEGIOIIC; Supplier Part Number: MCP1700T-5002E/MB IC Ổn Áp 5V 250mA; Supplier Link: https://www.thegioiic.com/mcp1700t-5002e-mb-ic-on-ap-5v-250ma
VR1000 VR1001 = FF-0047: VARIABLE RESISTOR SMD 10KR OHM 20% 150mW N/A; Design Item ID: FF-0047; Size: N/A; Type: VARIABLE RESISTOR; TH/SMD: SMD; Value: 10KR; Tolerance: 20%; Voltage: N/A; Supplier: N/A; Supplier Part Number: 10K Ohm, 20%; Supplier Link: https://www.thegioiic.com/evm3e-103-bien-tro-10-kohm-nut-ao-smd-0-15w
X1000 = FF-3005: LCD 2.8inch 240x320 HMI ILI9341; TH/SMD: TH; Design Item ID: FF-3005; Type: LCD; Value: N/A; Tolerance: N/A; Voltage: N/A; Power Rate: N/A; Size: N/A; Supplier: THEGIOIIC; Supplier Part Number: LCD 2.8inch 240x320 HMI ILI9341; Supplier Link: https://www.thegioiic.com/lcd-2-8inch-240x320-hmi-ili9341-cam-ung-dien-tro-giao-tiep-spi
X1002 = FF-3004: Terminal Block 20; TH/SMD: TH; Voltage: 250V; Design Item ID: FF-3004; Type: CONNECTOR; Value: N/A; Tolerance: N/A; Power Rate: N/A; Size: 5.08mm; Supplier: THEGIOIIC; Supplier Part Number: KF142-5.08-20-R; Supplier Link: https://www.thegioiic.com/kf142-5-08-12-r-terminal-block-12-tiep-diem-cam-day-ngang-5-08mm-250v-10a / https://www.thegioiic.com/kf142-5-08-8-r-terminal-block-8-tiep-diem-cam-day-ngang-5-08mm-250v-10a

## Sheet TTL-RS485.SchDoc
size 420 x 297 mm; Author: Nguyễn Huy Hoàng; SheetNumber: 2; SheetTotal: 5; Instructor: Nguyễn Trung Hiếu
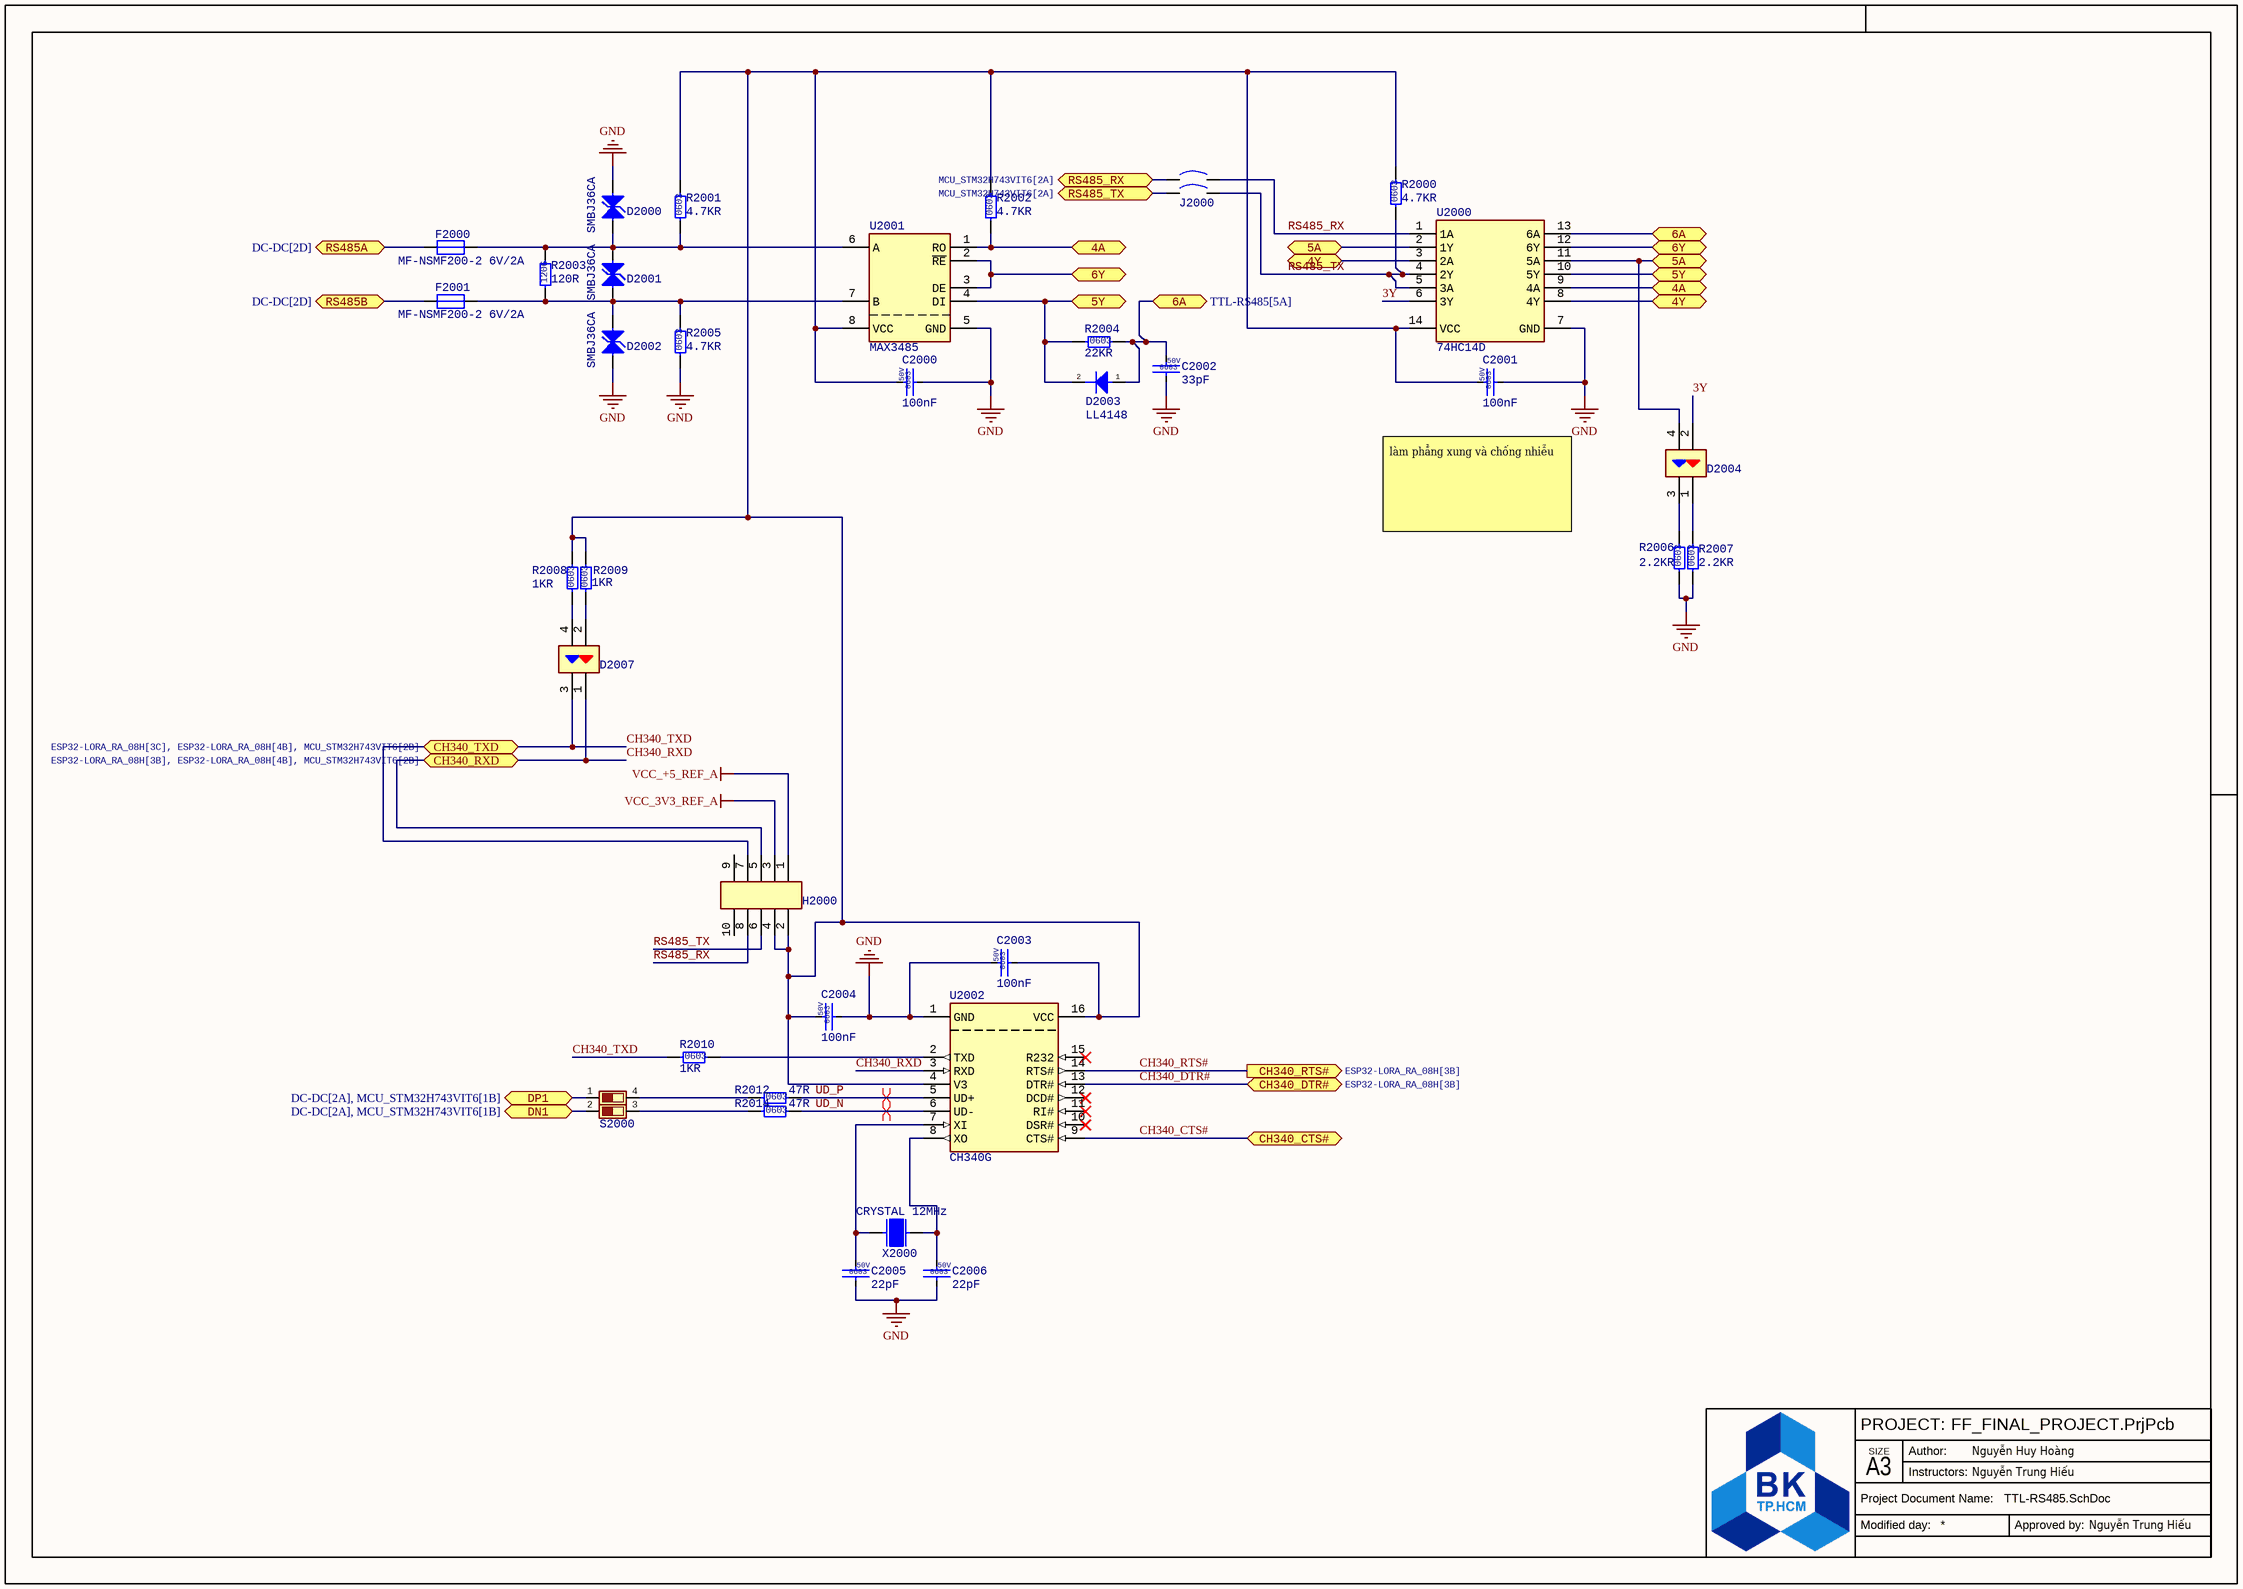
[diagram p2: TTL-RS485.SchDoc]

### Parts
C2000  100nF  Voltage: 50V  Size: 0603  [CAP CER 0603]
C2001  100nF  Voltage: 50V  Size: 0603  [CAP CER 0603]
C2002  33pF  Voltage: 50V  Size: 0603  [CAP CER 0603]
C2003  100nF  Voltage: 50V  Size: 0603  [CAP CER 0603]
C2004  100nF  Voltage: 50V  Size: 0603  [CAP CER 0603]
C2005  22pF  Voltage: 50V  Size: 0603  [CAP CER 0603]
C2006  22pF  Voltage: 50V  Size: 0603  [CAP CER 0603]
D2000  SMBJ36CA  [DO-214AA]
D2001  SMBJ36CA  [DO-214AA]
D2002  SMBJ36CA  [DO-214AA]
D2003  LL4148  [SOD-80]
D2004  LED R/B 0805  [LED RB 0805]  (value not drawn)
D2007  LED R/B 0805  [LED RB 0805]  (value not drawn)
F2000  MF-NSMF200-2 6V/2A  [FUSE 1206]
F2001  MF-NSMF200-2 6V/2A  [FUSE 1206]
H2000  HEADER 5X2  [HEADER 5X2]  (value not drawn)
J2000  JUMPER 2X2  [JUMPER 2X2]  (value not drawn)
R2000  4.7KR  Size: 0603  [RESC 0603(1608) SMD]
R2001  4.7KR  Size: 0603  [RESC 0603(1608) SMD]
R2002  4.7KR  Size: 0603  [RESC 0603(1608) SMD]
R2003  120R  Size: 1206  [RESC 1206(3116) SMD]
R2004  22KR  Size: 0603  [RESC 0603(1608) SMD]
R2005  4.7KR  Size: 0603  [RESC 0603(1608) SMD]
R2006  2.2KR  Size: 0603  [RESC 0603(1608) SMD]
R2007  2.2KR  Size: 0603  [RESC 0603(1608) SMD]
R2008  1KR  Size: 0603  [RESC 0603(1608) SMD]
R2009  1KR  Size: 0603  [RESC 0603(1608) SMD]
R2010  1KR  Size: 0603  [RESC 0603(1608) SMD]
R2012  47R  Size: 0603  [RESC 0603(1608) SMD]
R2014  47R  Size: 0603  [RESC 0603(1608) SMD]
S2000  DIP-2  [DIP-2 SWITCH]  (value not drawn)
U2000  74HC14D  [SOIC-14]
U2001  MAX3485  [SOP-8]
U2002  CH340G  [SOP-16]
X2000  CRYSTAL 12MHz  [CRYSTAL 5032 2PIN]

### Ports
4A (bidir, see TTL-RS485[3A]), 4A (bidir, see TTL-RS485[5A]), 4Y (bidir, see TTL-RS485[4A]), 4Y (bidir, see TTL-RS485[5A]), 5A (bidir, see TTL-RS485[4A]), 5A (bidir, see TTL-RS485[5A]), 5Y (bidir, see TTL-RS485[3A]), 5Y (bidir, see TTL-RS485[5A]), 6A (bidir, see TTL-RS485[4A]), 6A (bidir, see TTL-RS485[5A]), 6Y (bidir, see TTL-RS485[3A]), 6Y (bidir, see TTL-RS485[5A]), CH340_CTS# (bidir), CH340_DTR# (bidir, see ESP32-LORA_RA_08H[3B]), CH340_RTS# (out, see ESP32-LORA_RA_08H[3B]), CH340_RXD (bidir, see ESP32-LORA_RA_08H[3B], ESP32-LORA_RA_08H[4B], MCU_STM32H743VIT6[2B]), CH340_TXD (bidir, see ESP32-LORA_RA_08H[3C], ESP32-LORA_RA_08H[4B], MCU_STM32H743VIT6[2B]), DN1 (bidir, see DC-DC[2A], MCU_STM32H743VIT6[1B]), DP1 (bidir, see DC-DC[2A], MCU_STM32H743VIT6[1B]), RS485_RX (bidir, see MCU_STM32H743VIT6[2A]), RS485_TX (bidir, see MCU_STM32H743VIT6[2A]), RS485A (bidir, see DC-DC[2D]), RS485B (bidir, see DC-DC[2D])

### Nets
GND: C2000.2 C2001.2 C2002.2 C2003.1 C2004.2 C2005.2 C2006.2 D2000.1 D2002.2 R2005.1 R2006.1 R2007.1 U2000.7(GND) U2001.5(GND) U2002.1(GND)
VCC_3V3_REF_A: H2000.3  [project net VCC_3V3_LORA]
VCC_+5_REF_A: H2000.1
3Y: D2004.2 U2000.6(3Y)
CH340_CTS#: U2002.9(CTS#) ; port CH340_CTS#
CH340_DTR#: U2002.13(DTR#) ; port CH340_DTR#
CH340_RTS#: U2002.14(RTS#) ; port CH340_RTS#
CH340_RXD: D2007.1 H2000.5 U2002.3(RXD) ; port CH340_RXD
CH340_TXD: D2007.3 H2000.7 R2010.1 ; port CH340_TXD
D1_N: S2000.2 ; port DN1
D1_P: S2000.1 ; port DP1
RS485_RX: H2000.8 J2000.2 U2000.1(1A)
RS485_TX: H2000.6 J2000.4 R2000.1 U2000.4(2Y) U2000.5(3A)
RS485A: F2000.1 ; port RS485A
RS485B: F2001.1 ; port RS485B
UD_N: R2014.2 U2002.6(UD-)
UD_P: R2012.2 U2002.5(UD+)
NetC2000_1: C2000.1 C2001.1 C2003.2 C2004.1 H2000.2 H2000.4 R2000.2 R2001.2 R2002.2 R2008.2 R2009.2 U2000.14(VCC) U2001.8(VCC) U2002.4(V3) U2002.16(VCC)
NetC2002_1: C2002.1 D2003.1(A) R2004.2 U2000.13(6A) ; port 6A
NetC2005_1: C2005.1 U2002.7(XI) X2000.1
NetC2006_1: C2006.1 U2002.8(XO) X2000.2
NetD2000_2: D2000.2 D2001.1 F2000.2 R2001.1 R2003.2 U2001.6(A)
NetD2001_2: D2001.2 D2002.1 F2001.2 R2003.1 R2005.2 U2001.7(B)
NetD2003_2: D2003.2(K) R2004.1 U2000.10(5Y) U2001.4(DI) ; port 5Y
NetD2004_1: D2004.1 R2007.2
NetD2004_3: D2004.3 R2006.2
NetD2004_4: D2004.4 U2000.2(1Y) U2000.11(5A) ; port 5A
NetD2007_2: D2007.2 R2009.1
NetD2007_4: D2007.4 R2008.1
NetJ2000_1: J2000.1 ; port RS485_RX
NetJ2000_3: J2000.3 ; port RS485_TX
NetR2002_1: R2002.1 U2000.9(4A) U2001.1(RO) ; port 4A
NetR2010_2: R2010.2 U2002.2(TXD)
NetR2012_1: R2012.1 S2000.4
NetR2014_1: R2014.1 S2000.3
NetU2000_3: U2000.3(2A) U2000.8(4Y) ; port 4Y
NetU2000_12: U2000.12(6Y) U2001.2(~{RE}) U2001.3(DE) ; port 6Y

Not connected (* = marked no-connect by the designer): H2000 9 10; U2002 10(DSR#)* 11(RI#)* 12(DCD#)* 15(R232)*

### Layout directives
differential pair: UD_N, UD_P

### Notes on the sheet
- làm phẳng xung và chống nhiễu
- PROJECT:
- SIZE
- Author:
- Instructors:
- Project Document Name:
- Modified day:
- A3
- Approved by:

### Library data of the parts
C2000 C2001 C2003 C2004 = FF-1008: as C1018 on sheet DC-DC; Value: 100nF; Design Item ID: FF-1008; TH/SMD: SMD; Tolerance: 10%; Power Rate: N/A; Supplier: THEGIOIIC; Supplier Link: https://www.thegioiic.com/tu-gom-0603-100nf-0-1uf-50v; Supplier Part Number: 10%, 0603 (1608 Metric)
C2002 = FF-1007: CAP CER SMD 33pF 10% 50V 0603; Type: CAP CER; Value: 33pF; Design Item ID: FF-1007; TH/SMD: SMD; Tolerance: 10%; Power Rate: N/A; Supplier: THEGIOIIC; Supplier Part Number: 10%, 0603 (1608 Metric); Supplier Link: https://www.thegioiic.com/tu-gom-0603-33pf-50v
C2005 C2006 = FF-1032: CAP CER SMD 22pF 10% 50V 0603; Type: CAP CER; Design Item ID: FF-1032; TH/SMD: SMD; Value: 22pF; Tolerance: 10%; Power Rate: N/A; Supplier: THEGIOIIC; Supplier Part Number: 10%, 0603 (1608 Metric); Supplier Link: https://www.thegioiic.com/tu-gom-0603-22pf-50v
D2000-D2002 = FF-4014: TVS DIODE 36V 58.1V DO214AA; TH/SMD: SMD; Design Item ID: FF-4014; Type: TVS DIODE; Value: 36V 58.1V; Tolerance: N/A; Voltage: 36V 58.1V; Power Rate: N/A; Size: DO214AA; Supplier: THEGIOIIC; Supplier Part Number: SMBJ36CA; Supplier Link: https://www.thegioiic.com/smbj36ca
D2003 = FF-4013: 0.2A, 100V, SOD80; TH/SMD: SMD; Value: 100V/0.2A; Design Item ID: FF-4013; Type: DIODE; Tolerance: N/A; Voltage: 100V; Power Rate: N/A; Size: SOD-80; Supplier: THEGIOIIC; Supplier Part Number: LL4148; Supplier Link: https://www.thegioiic.com/ll4148-diode-chinh-luu-0-2a-100v
D2004 D2007 = FF-4019: LED 2 Màu Đỏ, Xanh Dương 0805 Dán SMD Trong Suốt; Type: LED R/B; Value: 0805; Design Item ID: FF-4019; TH/SMD: SMD; Tolerance: N/A; Voltage: N/A; Power Rate: N/A; Size: 0805; Supplier: THEGIOIIC; Supplier Part Number: LED 2 Màu Đỏ, Xanh Dương 0805 Dán SMD Trong Suốt; Supplier Link: https://www.thegioiic.com/led-2-mau-do-xanh-duong-0805-dan-smd-trong-suot
F2000 F2001 = FF-4008: as F1001 on sheet DC-DC; Value: 6V/2A; Design Item ID: FF-4008; Type: FUSE; Tolerance: N/A; Power Rate: N/A; Size: 1206; Supplier: THEGIOIIC; Supplier Part Number: MF-NSMF200-2; Supplier Link: https://www.thegioiic.com/mf-nsmf200-2-cau-chi-tu-phuc-hoi-1206-6v-2a
H2000 = FF-3020: TH/SMD: TH; Design Item ID: FF-3020; Type: JUMPER; Value: N/A; Tolerance: N/A; Voltage: N/A; Power Rate: N/A; Size: 5X2 X 2.54mm; Supplier: N/A; Supplier Part Number: N/A; Supplier Link: N/A
J2000 = FF-3019: TH/SMD: TH; Design Item ID: FF-3019; Type: JUMPER; Value: N/A; Tolerance: N/A; Voltage: N/A; Power Rate: N/A; Size: 2X2 X 2.54mm; Supplier: N/A; Supplier Part Number: N/A; Supplier Link: N/A
R2000-R2002 R2005 = FF-0016: RESISTOR SMD 4.7KR OHM 1% 100mW 0603; Type: RESISTOR; TH/SMD: SMD; Value: 4.7KR; Tolerance: 1%; Voltage: N/A; Power Rate: 100mW; Supplier: THEGIOIIC; Supplier Part Number: 472, 1/10W; Supplier Link: https://www.thegioiic.com/dien-tro-4-7-kohm-0603-1-; Design Item ID: FF-0016
R2003 = FF-0033: RESISTOR SMD 120R OHM 1% 250mW 1206; Type: RESISTOR; TH/SMD: SMD; Value: 120R; Tolerance: 1%; Voltage: N/A; Power Rate: 250mW; Supplier: THEGIOIIC; Supplier Part Number: 121, 1/4W; Supplier Link: https://www.thegioiic.com/dien-tro-120-ohm-1206-1-; Design Item ID: FF-0033
R2004 = FF-0025: RESISTOR SMD 22KR OHM 1% 100mW 0603; Type: RESISTOR; TH/SMD: SMD; Value: 22KR; Tolerance: 1%; Voltage: N/A; Power Rate: 100mW; Supplier: THEGIOIIC; Supplier Part Number: 223, 1/10W; Supplier Link: https://www.thegioiic.com/dien-tro-22-kohm-0603-1-; Design Item ID: FF-0025
R2006 R2007 = FF-0009: RESISTOR SMD 2.2KR OHM 1% 100mW 0603; Type: RESISTOR; TH/SMD: SMD; Value: 2.2KR; Tolerance: 1%; Voltage: N/A; Power Rate: 100mW; Supplier: THEGIOIIC; Supplier Part Number: 222, 1/10W; Supplier Link: https://www.thegioiic.com/dien-tro-2-2-kohm-0603-1-; Design Item ID: FF-0009
R2008-R2010 = FF-0037: RESISTOR SMD 1KR OHM 1% 100mW 0603; Power Rate: 100mW; Design Item ID: FF-0037; Type: RESISTOR; TH/SMD: SMD; Value: 1KR; Tolerance: 1%; Voltage: N/A; Supplier: THEGIOIIC; Supplier Part Number: Code 102, 1/10W; Supplier Link: https://www.thegioiic.com/dien-tro-1-kohm-0603-1-
R2012 R2014 = FF-0028: RESISTOR SMD 47R OHM 1% 100mW 0603; Power Rate: 100mW; Design Item ID: FF-0028; Type: RESISTOR; TH/SMD: SMD; Value: 47R; Tolerance: 1%; Voltage: N/A; Supplier: THEGIOIIC; Supplier Part Number: 47R (Code 470), 1/10W; Supplier Link: https://www.thegioiic.com/dien-tro-47-ohm-0603-1-
S2000 = FF-3009: DIP SWITCH 1.27mm 2 CONTACT; TH/SMD: SMD; Design Item ID: FF-3009; Type: SWITCH; Value: N/A; Tolerance: N/A; Voltage: N/A; Power Rate: N/A; Size: 2 X 1.27mm; Supplier: THEGIOIIC; Supplier Part Number: Công Tắc DIP Switch Dán SMD 2 Bit 1.27mm; Supplier Link: https://www.thegioiic.com/cong-tac-dip-switch-dan-smd-2-bit-1-27mm
U2000 = FF-2001: Inverters HEX INV SCHMITT TRIG; TH/SMD: SMD; Design Item ID: FF-2001; Type: IC; Value: 74HC14D; Tolerance: N/A; Voltage: N/A; Power Rate: N/A; Size: SOIC-14; Supplier: THEGIOIIC; Supplier Part Number: 74HC14D,652; Supplier Link: https://www.thegioiic.com/74hc14d-652-hex-schmitt-trigger-inverter-14-soic
U2001 = FF-2009: 3.3V, 10Mbps Half-Duplex RS-485/RS-422 Transceivers; TH/SMD: SMD; Design Item ID: FF-2009; Type: IC; Value: MAX3485; Tolerance: N/A; Voltage: N/A; Power Rate: N/A; Size: SOP-8; Supplier: THEGIOIIC
U2002 = FF-2021: CH340G USB to UART Interface; TH/SMD: SMD; Design Item ID: FF-2021; Type: IC; Value: CH340G; Tolerance: N/A; Voltage: N/A; Power Rate: N/A; Size: SOP-16; Supplier: THEGIOIIC; Supplier Part Number: CH340G; Supplier Link: https://www.thegioiic.com/ch340g
X2000 = FF-4020: CRYSTAL 12MHz 2PIN SMD 5 x 3.2mm, ±20ppm 12pF; Design Item ID: FF-4020; Type: CRYSTAL; TH/SMD: SMD; Value: 12MHz; Tolerance: N/A; Voltage: N/A; Power Rate: N/A; Size: 5032; Supplier: THEGIOIIC; Supplier Part Number: Thạch Anh 12MHz 5032 2 Chân SMD; Supplier Link: https://www.thegioiic.com/thach-anh-12mhz-5032-2-chan-smd